# Altium project 电机驱动.PrjPCB
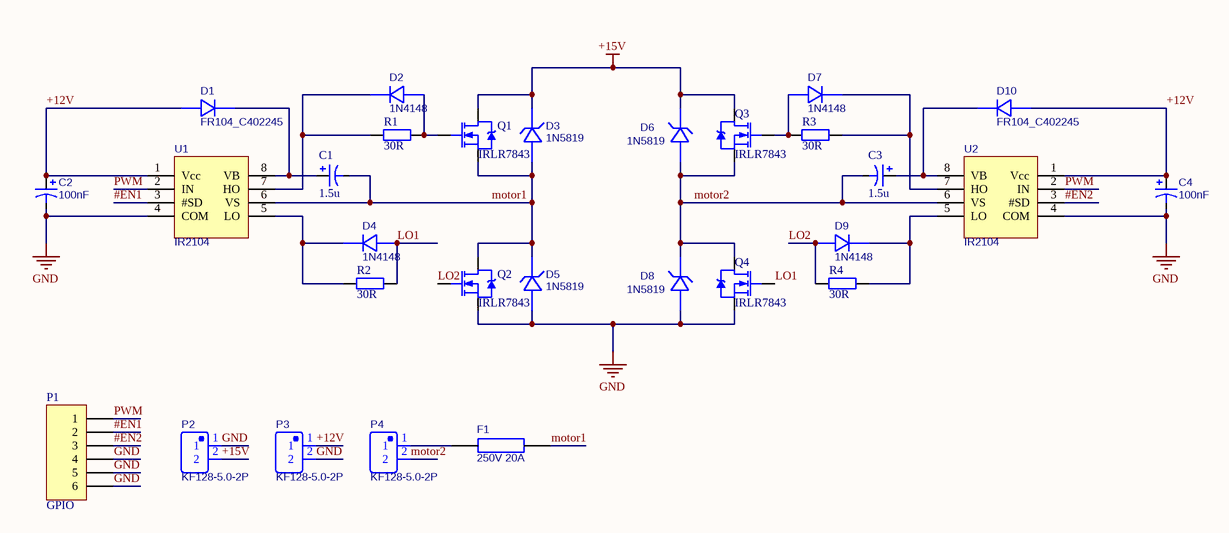
[diagram p0: 电机驱动.SchDoc]
1 sheet, 29 parts. Net scope: global (net labels, ports and power ports of the same name join across sheets).
Board file: 电机驱动.PcbDoc

## Sheet 电机驱动.SchDoc
size A4

### Parts
C1  1.5u  [CAP.1/.2]
C2  100nF  [CAP-SMD_BD4.0-L4.3-W4.3-FD]
C3  1.5u  [CAP.1/.2]
C4  100nF  [CAP-SMD_BD4.0-L4.3-W4.3-FD]
D1  FR104_C402245  [DO-41_BD2.4-L4.7-P8.70-D0.9-RD]
D2  1N4148  [DO-35_BD2.0-L4.2-P8.20-D0.5-RD]
D3  1N5819  [DO-41_BD2.4-L4.7-P8.70-D0.9-RD]
D4  1N4148  [DO-35_BD2.0-L4.2-P8.20-D0.5-RD]
D5  1N5819  [DO-41_BD2.4-L4.7-P8.70-D0.9-RD]
D6  1N5819  [DO-41_BD2.4-L4.7-P8.70-D0.9-RD]
D7  1N4148  [DO-35_BD2.0-L4.2-P8.20-D0.5-RD]
D8  1N5819  [DO-41_BD2.4-L4.7-P8.70-D0.9-RD]
D9  1N4148  [DO-35_BD2.0-L4.2-P8.20-D0.5-RD]
D10  FR104_C402245  [DO-41_BD2.4-L4.7-P8.70-D0.9-RD]
F1  250V 20A  [FUSE-SMD_5*20MM]
P1  GPIO  [HDR1X6]
P2  KF128-5.0-2P  [CONN-TH_P5.00_KF128-5.0-2P]
P3  KF128-5.0-2P  [CONN-TH_P5.00_KF128-5.0-2P]
P4  KF128-5.0-2P  [CONN-TH_P5.00_KF128-5.0-2P]
Q1  IRLR7843  [TO-220散热1]
Q2  IRLR7843  [TO-220散热1]
Q3  IRLR7843  [TO-220散热1]
Q4  IRLR7843  [TO-220散热1]
R1  30R  [0805R]
R2  30R  [0805R]
R3  30R  [0805R]
R4  30R  [0805R]
U1  IR2104  [SOIC-8_L4.9-W3.9-P1.27-LS6.0-BL]
U2  IR2104  [SOIC-8_L4.9-W3.9-P1.27-LS6.0-BL]

### Nets
+15V: D3.1(C) D6.1(C) P2.2 Q1.2(D) Q3.2(D)
GND: C2.2 C4.2 D5.2(A) D8.2(A) P1.4 P1.5 P1.6 P2.1 P3.2 Q2.3(S) Q4.3(S) U1.4(COM) U2.4(COM)
#EN1: P1.2 U1.3(#SD)
#EN2: P1.3 U2.3(#SD)
+12V: C2.1 C4.1 D1.2(A) D10.2(A) P3.1 U1.1(Vcc) U2.1(Vcc)
LO1: D4.2 Q4.1(G) R2.2
LO2: D9.2 Q2.1(G) R4.2
motor1: C1.2 D3.2(A) D5.1(C) F1.2 Q1.3(S) Q2.2(D) U1.6(VS)
motor2: C3.2 D6.2(A) D8.1(C) P4.2 Q3.3(S) Q4.2(D) U2.6(VS)
PWM: P1.1 U1.2(IN) U2.2(IN)
NetC1_1: C1.1 D1.1(C) U1.8(VB)
NetC3_1: C3.1 D10.1(C) U2.8(VB)
NetD2_1: D2.1 R1.1 U1.7(HO)
NetD2_2: D2.2 Q1.1(G) R1.2
NetD4_1: D4.1 R2.1 U1.5(LO)
NetD7_1: D7.1 R3.1 U2.7(HO)
NetD7_2: D7.2 Q3.1(G) R3.2
NetD9_1: D9.1 R4.1 U2.5(LO)
NetF1_1: F1.1 P4.1

### Library data of the parts
C1 C3 = CAP+: Capacitor
C2 C4 = 贴片电容: BOM_Manufacturer: Changzhou Huawei Elec; BOM_Manufacturer Part: VT1H0R1MB054000CE0; nameAlias: Capacitance; Contributor: LCSC; BOM_Supplier: LCSC; BOM_Supplier Part: C271438; spicePre: C; spiceSymbolName: VT1H0R1MB054000CE0
D1 D10 = FR104_C402245: BOM_Manufacturer: LGE; BOM_Manufacturer Part: FR104; Contributor: LCSC; BOM_Supplier: LCSC; BOM_Supplier Part: C402245; spicePre: D; spiceSymbolName: FR104_C402245
D2 D4 D7 D9 = 1N4148: BOM_Manufacturer: Semtech; BOM_Manufacturer Part: IN4148; Contributor: LCSC; BOM_Supplier: LCSC; BOM_Supplier Part: C14538; spicePre: D; spiceSymbolName: IN4148
D3 D5 D6 D8 = 1N5819_C402218: BOM_Manufacturer: LGE; Contributor: LCSC; BOM_Supplier: LCSC; BOM_Supplier Part: C402218; BOM_Manufacturer Part: 1N5819; spicePre: D; spiceSymbolName: 1N5819_C402218
F1 = 保险丝20A: BOM_Manufacturer Part: 250V 20A Glass tube fuse; BOM_Manufacturer: XCFuse; BOM_Supplier: LCSC; image: //image.lceda.cn/szlcsc/C13567.jpg; BOM_Supplier Part: C13567; spicePre: F; spiceSymbolName: 250V 20A Glass tube fuse
P1 = Header 6: Header, 6-Pin; LatestRevisionDate: 17-Jul-2002; LatestRevisionNote: Re-released for DXP Platform.; Publisher: Altium Limited
P2-P4 = KF128-2P: BOM_Manufacturer: Cixi Kefa Elec; Contributor: LCSC; BOM_Supplier: LCSC; BOM_Supplier Part: C474950; BOM_Manufacturer Part: KF128-5.0-2P; spicePre: U; spiceSymbolName: KF128-5.0-2P
Q1-Q4 = RU7088
R1-R4 = Res: Resistor
U1 U2 = IR2104: BOM_Manufacturer: IR; BOM_Manufacturer Part: IR2104STRPBF; SMT Type: Extend; spicePre: X; BOM_Supplier: LCSC; image: //image.lceda.cn/szlcsc/C2960.jpg; BOM_Supplier Part: C2960; BOM_LCSC Assembly: Yes; spiceSymbolName: IR2104STRPBF